# EasyEDA Pro project 毕业设计.eprj, board PCB2
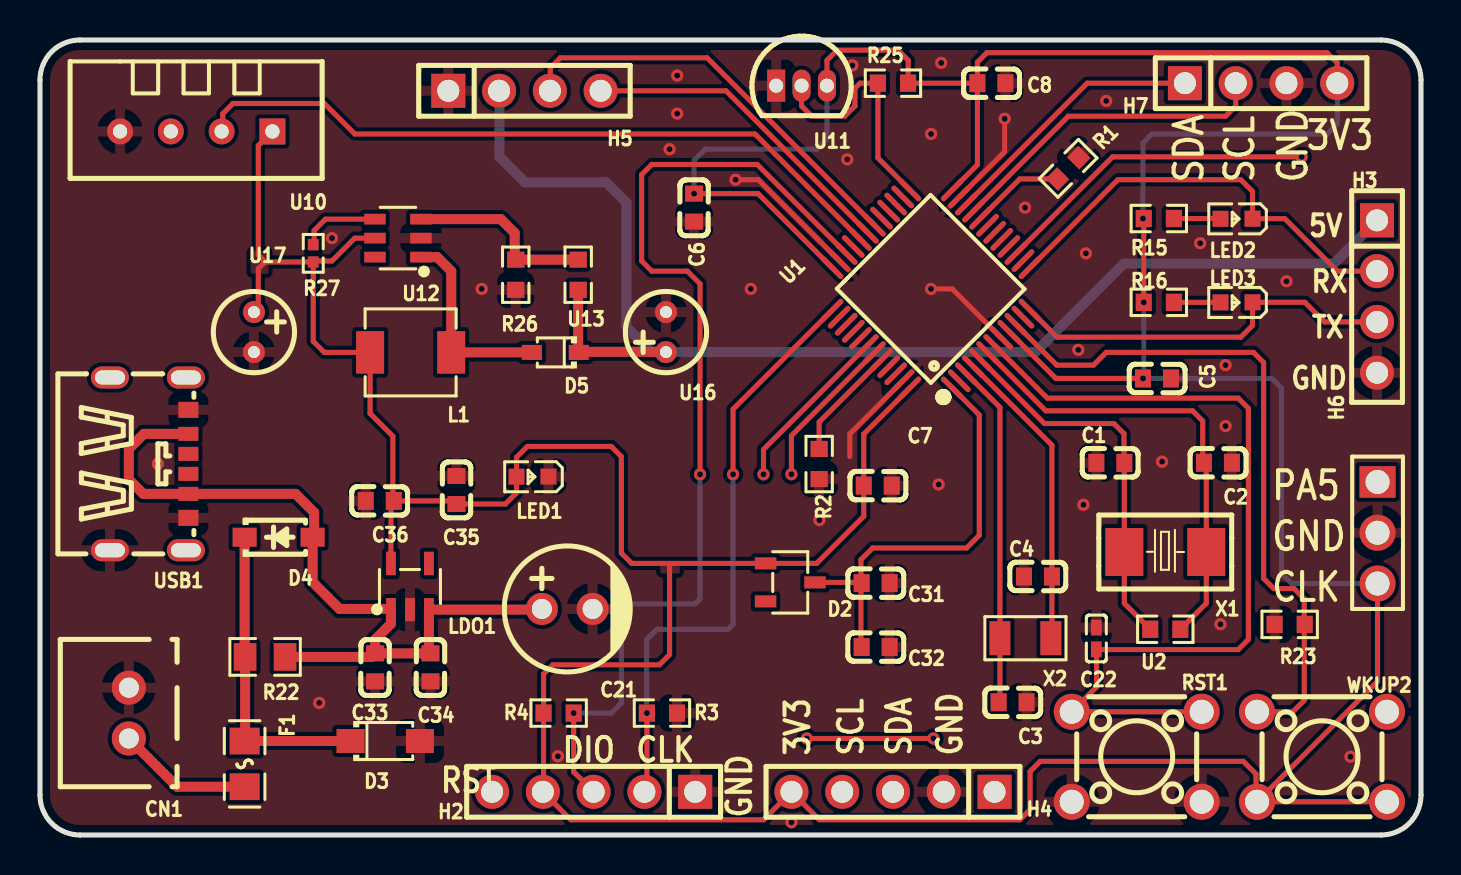
[diagram p5: board, top side]
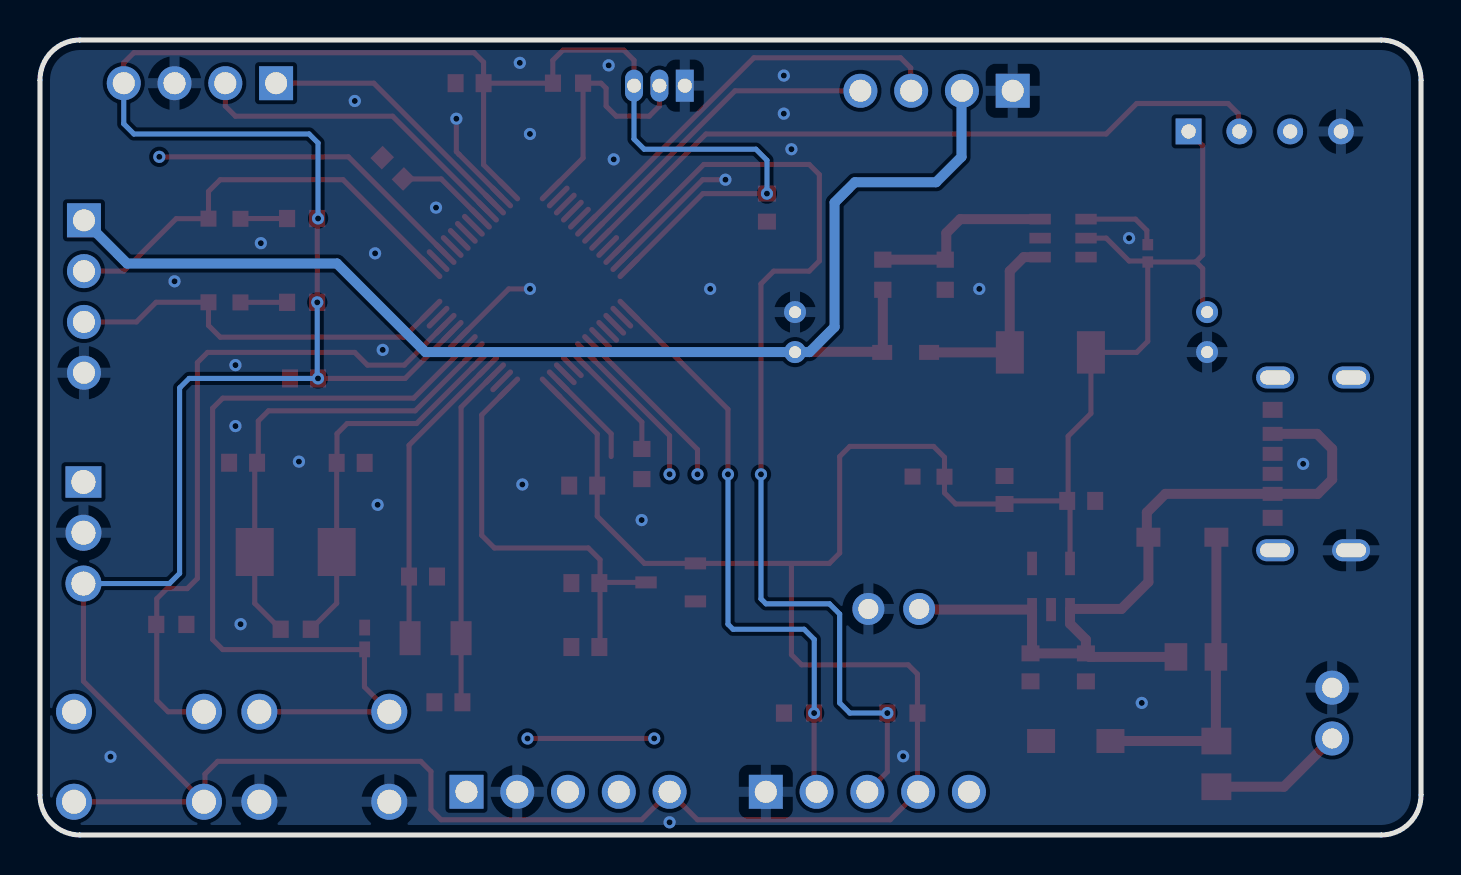
[diagram p6: board, bottom side, seen from below]

Outline 69.09 x 39.75 mm; copper layers: Top Layer, Inner1, Inner2, Bottom Layer. Coordinates in mm from the lower left corner of the outline.
Outline path: 0,37.75 0,2 arc(0.59,0.59) 2,0 67.09,0 arc(68.5,0.59) 69.09,2 69.09,37.75 arc(68.5,39.17) 67.09,39.75 2,39.75 arc(0.59,39.17) 0,37.75
Stack: Top Layer 0.035mm / Dielectric1 1.51mm FR4 er 4.5 / Inner1 0.035mm / Dielectric2 0.48mm PP er 4.5 / Inner2 0.035mm / Dielectric3 0.48mm PP er 4.5 / Bottom Layer 0.035mm

## Design rules (mm)
template: JLCPCB Capability(Two Layers Board)
spacing copperThickness1oz (default): track to track 0.102, other pairs 0.152 to 0.3
spacing copperThickness2oz: track to track 0.203, other pairs 0.152 to 0.3
track width copperThickness1oz (default): min 0.127, default 0.254, max 2.54
track width copperThickness2oz: min 0.203, default 0.254, max 2.54
differential pair differentialPair (default): width min 0.127, default 0.254, max 2.54; gap min 0.152, default 0.152
via viaSize (default): diameter min 0.5, default 0.61, max 10; hole min 0.3, default 0.305, max 6.3

## Placement (name value [footprint] x y rotation side)
C1  20pF  [C0603]  53.55 18.61 0 top
C2  20pF  [C0603]  58.93 18.61 180 top
C3  20pF  [C0603]  48.66 6.64 180 top
C4  20pF  [C0603]  49.92 12.92 0 top
C5  100nF  [C0603]  55.88 22.83 180 top
C6  100nF  [C0603]  32.72 31.37 90 top
C7  100nF  [C0603]  41.91 17.47 180 top
C8  100nF  [C0603]  47.6 37.59 180 top
C21  220uF  [CAP-TH_BD6.3-P2.50-D1.0-FD]  26.38 11.3 0 top
C22  100nF  [C0402]  52.85 9.83 90 top
C31  100nF  [C0603]  41.8 12.6 180 top
C32  100nF  [C0603]  41.8 9.4 180 top
C33  100nF  [C0603]  16.76 8.38 90 top
C34  100nF  [C0603]  19.54 8.38 90 top
C35  100nF  [C0603]  20.84 17.25 270 top
C36  100nF  [C0603]  17 16.71 0 top
CN1  B2B-XH-A(LF)(SN)  [CONN-TH_B2B-XH-A-LF-SN]  4.45 6.1 90 top
D2  BAT54C  [SOT-23-3_L2.9-W1.6-P1.90-LS2.8-BR]  37.53 12.63 180 top
D3  SMF5.0A  [SOD-123FL_L2.7-W1.8-LS3.8-RD]  17.27 4.7 0 top
D4  B5819W SL  [SOD-123_L2.7-W1.6-LS3.7-RD-1]  11.94 14.89 0 top
D5  1SS315TPH3F  [SOD-323_L1.8-W1.3-LS2.5-RD]  25.78 24.13 180 top
F1  BSMD0805-100-6V  [F0805]  10.24 3.56 90 top
H2  PZ254V-11-05P  [HDR-TH_5P-P2.54-V-M]  27.7 2.16 180 top
H3  2.54-1*4P母  [HDR-TH_4P-P2.54-V-F]  66.89 26.92 270 top
H4  PZ254V-11-05P  [HDR-TH_5P-P2.54-V-M]  42.67 2.16 180 top
H5  2.54-1*4P母  [HDR-TH_4P-P2.54-V-F]  24.24 37.21 0 top
H6  2.54-1*3P针  [HDR-TH_3P-P2.54-V-M-1]  66.91 15.11 270 top
H7  2.54-1*4P母  [HDR-TH_4P-P2.54-V-F]  61.09 37.59 0 top
L1  4.7uH  [IND-SMD_L4.4-W4.2]  18.54 24.13 180 top
LDO1  ME6211C33M5G-N  [SOT-23-5_L3.0-W1.7-P0.95-LS2.8-BL]  18.51 12.42 0 top
LED1  NCD0603R1  [LED0603-RD_RED]  24.64 17.92 180 top
LED2  19-217/GHC-YR1S2/3T  [LED0603-RD]  59.86 30.81 180 top
LED3  NCD0603B1  [LED0603-RD]  59.86 26.63 180 top
R1  10kΩ  [R0603]  51.44 33.34 225 top
R2  10kΩ  [R0603]  38.98 18.55 90 top
R3  10kΩ  [R0603]  31.11 6.1 180 top
R4  10kΩ  [R0603]  25.95 6.1 0 top
R15  10kΩ  [R0603]  55.97 30.82 180 top
R16  10kΩ  [R0603]  55.97 26.63 180 top
R22  100mΩ  [R0805]  11.26 8.9 0 top
R23  10kΩ  [R0603]  62.52 10.53 180 top
R25  4.7kΩ  [R0603]  42.67 37.59 0 top
R26  10kΩ  [R0603]  23.8 28.01 90 top
R27  100kΩ  [R0402]  13.67 29.08 90 top
RST1  TS665CJ  [SW-TH_4P-L6.0-W6.0-P4.50-LS6.5]  54.86 3.91 0 top
U1  STM32F103C8T6  [LQFP-48_L7.0-W7.0-P0.50-LS9.0-BL]  44.58 27.3 45 top
U2  1MΩ  [R0603]  56.3 10.29 180 top
U10  DHT11  [SENSOR-TH_DHT11]  7.82 35.18 180 top
U11  DS18B20  [TO-92-3_L4.9-W3.7-P1.27-L]  38.1 37.47 0 top
U12  SX1308  [SOT-23-6_L2.9-W1.6-P0.95-LS2.8-BL]  17.91 29.84 90 top
U13  73.2kΩ  [R0603]  26.92 28.01 270 top
U16  22uF  [CAP-TH_BD4.0-P2.00-D0.5-FD]  31.32 25.15 90 top
U17  22uF  [CAP-TH_BD4.0-P2.00-D0.5-FD]  10.7 25.15 270 top
USB1  TYPE-C 6P(073)  [TYPE-C-SMD_TYPE-C-6P]  5.46 18.56 270 top
WKUP2  TS665CJ  [SW-TH_4P-L6.0-W6.0-P4.50-LS6.5]  64.14 3.91 0 top
X1  8MHz  [CRYSTAL-SMD_L5.0-W3.2]  56.3 14.15 180 top
X2  32.768kHz  [OSC-SMD_L3.2-W1.5]  49.3 9.84 180 top

## Footprints (pads in the part's own frame, mm; a bottom-side part is the same pattern mirrored in y, then rotated)
C0402
  rect 0.79x0.54 smd: 1(-0.545,0) 2(0.545,0)
C0603
  rect 0.8x0.9 smd: 1(-0.7,0) 2(0.7,0)
CAP-TH_BD4.0-P2.00-D0.5-FD
  round 1.1 hole 0.6: 1(-1,0) 2(1,0)
CAP-TH_BD6.3-P2.50-D1.0-FD
  round 1.6 hole 1: 1(-1.27,0) 2(1.27,0)
CONN-TH_B2B-XH-A-LF-SN
  round 1.7 hole 1: 1(1.27,0) 2(-1.27,0)
CRYSTAL-SMD_L5.0-W3.2
  rect 1.9x2.4 smd: 1(-2.05,0) 2(2.05,0)
F0805
  rect 1.335x1.5 smd: 1(-1.143,0) 2(1.143,0)
HDR-TH_3P-P2.54-V-M-1
  rect 1.575x1.8 hole 1.2: 1(-2.54,0)
  round 1.8 hole 1.2: 2(0,0) 3(2.54,0)
HDR-TH_4P-P2.54-V-F
  rect 1.7x1.7 hole 1.1: 1(-3.81,0)
  round 1.7 hole 1.1: 2(-1.27,0) 3(1.27,0) 4(3.81,0)
HDR-TH_5P-P2.54-V-M
  rect 1.7x1.7 hole 1.1: 1(-5.08,0)
  round 1.7 hole 1.1: 2(-2.54,0) 3(0,0) 4(2.54,0) 5(5.08,0)
IND-SMD_L4.4-W4.2
  rect 1.4x2.12 smd: 1(2.028,0) 2(-2.028,0)
LED0603-RD
  rect 0.8x0.8 smd: 1(-0.799,-0.004) 2(0.799,0.004)
LED0603-RD_RED
  rect 0.8x0.8 smd: 1(-0.799,-0.004) 2(0.799,0.004)
LQFP-48_L7.0-W7.0-P0.50-LS9.0-BL
  oval 0.27x1.5 smd: 1(-2.75,-4.25) 2(-2.25,-4.25) 3(-1.75,-4.25) 4(-1.25,-4.25) 5(-0.75,-4.25) 6(-0.25,-4.25) 7(0.25,-4.25) 8(0.75,-4.25) 9(1.25,-4.25) 10(1.75,-4.25) 11(2.25,-4.25) 12(2.75,-4.25) 25(2.75,4.25) 26(2.25,4.25) 27(1.75,4.25) 28(1.25,4.25) 29(0.75,4.25) 30(0.25,4.25) 31(-0.25,4.25) 32(-0.75,4.25) 33(-1.25,4.25) 34(-1.75,4.25) 35(-2.25,4.25) 36(-2.75,4.25)
  oval 1.5x0.27 smd: 13(4.25,-2.75) 14(4.25,-2.25) 15(4.25,-1.75) 16(4.25,-1.25) 17(4.25,-0.75) 18(4.25,-0.25) 19(4.25,0.25) 20(4.25,0.75) 21(4.25,1.25) 22(4.25,1.75) 23(4.25,2.25) 24(4.25,2.75) 37(-4.25,2.75) 38(-4.25,2.25) 39(-4.25,1.75) 40(-4.25,1.25) 41(-4.25,0.75) 42(-4.25,0.25) 43(-4.25,-0.25) 44(-4.25,-0.75) 45(-4.25,-1.25) 46(-4.25,-1.75) 47(-4.25,-2.25) 48(-4.25,-2.75)
OSC-SMD_L3.2-W1.5
  rect 1.05x1.7 smd: 1(-1.275,0) 2(1.275,0)
R0402
  rect 0.566x0.54 smd: 1(-0.433,0) 2(0.433,0)
R0603
  rect 0.806x0.864 smd: 1(-0.753,0) 2(0.753,0)
R0805
  rect 1.133x1.377 smd: 1(-1,0) 2(1,0)
SENSOR-TH_DHT11
  rect 1.296x1.296 hole 0.711: 1(-3.81,0)
  round 1.296 hole 0.711: 2(-1.27,0) 3(1.27,0) 4(3.81,0)
SOD-123_L2.7-W1.6-LS3.7-RD-1
  rect 1.2x0.95 smd: 1(-1.7,0) 2(1.7,0)
SOD-123FL_L2.7-W1.8-LS3.8-RD
  rect 1.4x1.2 smd: 1(-1.735,0) 2(1.735,0)
SOD-323_L1.8-W1.3-LS2.5-RD
  rect 1x0.75 smd: 1(-1.173,0) 2(1.173,0)
SOT-23-3_L2.9-W1.6-P1.90-LS2.8-BR
  rect 1.07x0.6 smd: 1(1.235,-0.95) 2(1.235,0.95) 3(-1.235,0)
SOT-23-5_L3.0-W1.7-P0.95-LS2.8-BL
  rect 0.49x1.157 smd: 1(-0.95,-1.153) 2(0,-1.153) 3(0.95,-1.153)
  rect 0.49x1.175 smd: 4(0.95,1.153) 5(-0.95,1.153)
SOT-23-6_L2.9-W1.6-P0.95-LS2.8-BL
  rect 0.532x1.072 smd: 1(-0.95,-1.149) 2(0,-1.149) 3(0.95,-1.149) 4(0.95,1.149) 5(0,1.149) 6(-0.95,1.149)
SW-TH_4P-L6.0-W6.0-P4.50-LS6.5
  round 1.8 hole 1.2: 1(-3.25,2.25) 2(3.25,2.25) 3(-3.25,-2.25) 4(3.25,-2.25)
TO-92-3_L4.9-W3.7-P1.27-L
  rect 0.9x1.6 hole 0.7: 1(-1.27,0)
  oval 0.9x1.6 hole 0.7: 2(0,0) 3(1.27,0)
TYPE-C-SMD_TYPE-C-6P
  oval 1.1x1.9 hole 0.7x1.5: 7(-4.32,1.837) 7(-4.32,-1.962) 7(4.32,1.837) 7(4.32,-1.962)
  rect 0.7x1 smd: A5(-0.5,1.962) A9(1.5,1.962) B5(0.5,1.962) B9(-1.5,1.962)
  rect 0.8x1 smd: A12(2.7,1.962) B12(-2.7,1.962)

## Nets
As in the schematic.

Pads without a net: D2 2; H4 1; LDO1 4; U1 2 11 14 16 17 18 19 26 27 28 29 33 38 41 45 46; U10 3; U12 6; USB1 A5 B5; WKUP2 2

## Via types
v1: diameter 0.61, hole 0.301, Top Layer to Bottom Layer, 44 vias

## Routing (per net, layer and track width the routed paths; a pad name or vN(x,y) marks a point on that pad's centre or on a via; arc(x,y) is an arc through that point)
3V3: length 261.3
  Top Layer w0.254: 11.27,28.65 11.25,28.65 10.92,28.32 10.92,26.37 U17.1 ; 11.27,28.65 R27.1 ; 11.27,28.65 10.92,29 10.92,34.47 U10.1 ; 46.9,37.59 46.9,33.51 U1.24 ; 46.9,37.59 R25.2 43.43,37.6 43.43,38.73 42.93,39.24 39.88,39.24 39.37,38.73 U11.3 ; 46.9,37.59 46.9,38.64 47.37,39.12 64.39,39.12 64.9,38.61 H7.4 ; R27.1 13.72,28.7 14.61,28.7 15.75,29.84 U12.5 ; R27.1 13.67,24.68 14.22,24.13 16.51,24.13 16.51,21.08 17.65,19.94 17.65,16.75 C36.2 ; C36.2 17.56,16.56 LDO1.5 ; C36.2 20.68,16.71 C35.2 23.28,16.55 23.84,17.11 LED1.2 23.84,18.89 24.38,19.43 28.58,19.43 29.08,18.92 29.08,14.1 29.6,13.58 D2.1 38.85,13.58 41.21,15.94 C7.2 41.21,20.05 U1.48 ; v1(32.72,32.07) 35.92,32.07 U1.36 ; H6.3 66.91,7.69 WKUP2.3 ; v1(55.18,22.83) 50.82,22.83 U1.9 ; R15.2 v1(55.22,26.63) ; WKUP2.3 60.83,1.71 60.83,3.05 60.2,3.68 50.04,3.68 49.53,3.17 49.53,1.27 49.02,0.76 38.99,0.76 H4.5 36.2,0.76 26.55,0.76 H2.4 25.19,2.19 25.19,8.05 25.65,8.51 30.99,8.51 31.5,9.02 31.5,13.58 ; WKUP2.3 WKUP2.4
  Bottom Layer w0.254: v1(55.18,30.82) 55.18,34.6 55.63,35.05 64.39,35.05 64.9,35.56 H7.4 ; v1(32.72,32.07) 32.72,33.74 33.27,34.29 38.86,34.29 39.37,34.8 U11.3 ; H6.3 62.61,12.57 62.1,13.08 62.1,22.35 61.63,22.83 v1(55.18,22.83) 55.22,22.87 v1(55.22,26.63)
4V2_IN: length 15.5
  Top Layer w0.5: D3.1 10.29,4.7 10.26,4.72 ; D4.1 10.24,8.93 R22.1 10.26,4.72 ; 10.26,4.72 F1.2
+5V: length 65.2
  Top Layer w0.5: 26.92,24.16 31.3,24.16 U16.1 ; 26.92,24.16 D5.1 ; 26.92,24.16 U13.2
  Bottom Layer w0.5: H5.2 22.99,37.19 22.99,33.91 24.26,32.64 28.32,32.64 29.34,31.62 29.34,25.4 30.59,24.15 U16.1 49.8,24.15 54.23,28.57 64.73,28.57 H3.1
GND: length 21.2
  Top Layer w0.254: v1(44.58,27.3) 45.64,27.3 48.11,24.83 ; 48.13,34.04 48.26,34.17 v1(48.26,35.81) ; 48.13,34.04 48.13,34.04 ; 48.13,34.04 U1.23 ; U1.35 35.93,32.77 v1(34.8,32.77) ; U1.47 40.51,20.06 40.51,18.92
  vias: v1(5.9,18.56) v1(13.97,6.6) v1(14.61,29.84) v1(22.1,27.3) v1(25.91,3.94) v1(31.5,34.29) v1(31.88,37.97) v1(31.88,36.07) v1(35.56,27.3) v1(37.59,0.63) v1(38.99,15.75) v1(40.39,33.78) v1(40.64,38.48) v1(44.58,35.05) v1(44.96,17.53) v1(45.08,38.61) v1(49.28,31.37) v1(51.94,24.26) v1(52.2,16.51) v1(52.32,29.08) v1(53.34,36.7) v1(56.13,18.67) v1(58.04,29.59) v1(59.05,10.54) v1(59.31,23.49) v1(59.31,20.45) v1(62.36,27.69) v1(65.56,3.91)
VBAT: length 21.1
  Top Layer w0.254: 41.07,12.63 41.07,9.43 C32.2 ; 41.07,12.63 41.07,13.77 41.66,14.35 46.36,14.35 46.99,14.99 46.99,21 U1.1 ; 41.07,12.63 C31.2 ; 41.07,12.63 D2.3
VBUS: length 40.5
  Top Layer w0.5: C33.2 16.76,9.77 17.56,10.56 LDO1.1 17.53,11.3 14.99,11.3 13.64,12.65 D4.2 13.72,14.97 13.72,16.13 12.79,17.06 USB1.A9 5.17,17.06 4.45,17.78 4.45,19.3 5.2,20.06 USB1.B9 ; C33.2 C34.2 19.46,9.16 LDO1.3 25.07,11.27 C21.1 ; C33.2 16.59,8.9 R22.2
BOOT0: length 5.8
  Top Layer w0.254: U1.44 38.98,20.65 R2.2
BOOT1: length 4.7
  Top Layer w0.254: R1.2 49.01,32.8 U1.20
DHT11: length 35.8
  Top Layer w0.254: U10.2 9.14,35.24 9.14,36.07 9.65,36.58 14.22,36.58 15.75,35.05 35.77,35.05 41.04,29.78
DS18B20: length 12.3
  Top Layer w0.254: U1.25 41.92,33.85 R25.1 41.02,37.59 40.77,37.34 40.77,36.45 40.26,35.94 38.61,35.94 38.1,36.45 U11.2
I2C1_SCL: length 27.7
  Top Layer w0.254: U1.42 36.2,19.28 v1(36.2,18.03)
  Inner1 w0.254: H4.4 40.13,5.59 39.5,6.22 36.7,6.22 36.2,6.73 v1(36.2,18.03)
I2C1_SDA: length 27.9
  Top Layer w0.254: U1.43 37.59,19.97 v1(37.59,18.04)
  Inner1 w0.254: v1(37.59,18.04) 37.59,8.25 38.23,7.62 41.78,7.62 42.67,6.73 H4.3
I2C2_SCL: length 16.4
  Top Layer w0.254: H7.2 59.82,36.45 59.31,35.94 51.45,35.94 46.7,31.19
I2C2_SDA: length 13.4
  Top Layer w0.254: H7.1 52.39,37.59 U1.22
NRST: length 75.4
  Top Layer w0.254: v1(38.36,4.83) v1(44.7,4.83) ; 52.86,9.27 52.86,7.4 RST1.1 RST1.2 ; 52.86,9.27 C22.1 ; 52.86,9.27 59.94,9.27 60.45,9.78 60.45,21.34 59.94,21.84 50.39,21.84 U1.7
  Inner1 w0.254: v1(44.7,4.83) 50.28,4.83 RST1.1 ; H2.5 22.62,4.33 23.11,4.83 v1(38.36,4.83)
OSC32_IN: length 17.1
  Top Layer w0.254: U1.3 48.02,21.38 X2.2 48.02,6.7 C3.2
OSC32_OUT: length 15.2
  Top Layer w0.254: X2.1 50.62,9.89 C4.2 50.62,19.49 46.7,23.42
OSC_IN: length 19
  Top Layer w0.254: U2.2 54.25,11.58 X1.2 C1.2 54.23,18.62 54.23,20.07 53.72,20.57 50.25,20.57 U1.5
OSC_OUT: length 23.2
  Top Layer w0.254: U1.6 50.32,21.21 57.66,21.21 58.17,20.7 58.17,18.67 58.35,18.5 X1.1 58.35,11.58 57.05,10.29
PA5: length 35.9
  Top Layer w0.254: v1(63.12,33.91) 53.66,33.91 U1.15
  Inner1 w0.254: H6.1 63.88,17.65 63.12,18.41 v1(63.12,33.91)
SWCLK: length 30.1
  Top Layer w0.254: U1.37 34.67,21.29 v1(34.67,18.03) ; 30.35,6.09 v1(30.36,6.1) 30.36,2.28 H2.2
  Bottom Layer w0.254: v1(30.36,6.1) 30.35,6.1 30.35,9.78 30.86,10.29 34.42,10.29 34.67,10.54 v1(34.67,18.03)
SWDIO: length 51.4
  Top Layer w0.254: v1(26.7,6.1) 26.7,3.16 H2.3 ; U1.34 35.88,33.53 30.61,33.53 30.1,33.02 30.1,28.7 30.61,28.19 32.39,28.19 33.02,27.56 v1(33.02,18.03)
  Bottom Layer w0.254: v1(26.7,6.1) 28.58,6.1 29.08,6.6 29.08,11.05 29.59,11.56 32.77,11.56 33.02,11.81 v1(33.02,18.03)
USART1_RX: length 16.3
  Top Layer w0.254: U1.31 34.32,37.21 H5.4
USART1_TX: length 21.1
  Top Layer w0.254: U1.30 33.37,38.86 26.04,38.86 25.53,38.35 25.53,37.23 H5.3
USART2_RX: length 21.9
  Top Layer w0.254: U1.13 53.93,32.77 60.07,32.77 60.66,32.18 LED2.1 62.27,30.82 64.9,28.19 H3.2
USART2_TX: length 19.7
  Top Layer w0.254: H3.3 64.26,25.65 63.28,26.64 LED3.1 60.66,25.48 60.07,24.89 50.88,24.89 U1.12
WKUP: length 34.7
  Top Layer w0.254: WKUP2.1 62.68,6.16 63.25,6.73 63.25,10.51 R23.1 63.25,10.55 63.25,11.81 62.74,12.32 61.72,12.32 61.21,12.83 61.21,23.62 60.71,24.13 53.34,24.13 52.7,23.49 50.86,23.49 U1.10
$1N2791: length 6.8
  Top Layer w0.5: CN1.2 6.86,2.41 F1.1
$1N10003: length 4
  Top Layer w0.254: U12.4 14.29,30.8 13.72,30.23 13.72,29.56 R27.2
$1N10023: length 9.9
  Top Layer w0.5: U12.1 19.87,28.89 20.57,28.19 20.57,24.13 ; 20.57,24.13 L1.2 ; 20.57,24.13 20.58,24.13 D5.2
$1N10031: length 9.5
  Top Layer w0.5: U12.3 23.05,30.8 23.75,30.1 23.75,28.82 R26.2 U13.1
$2N1003: length 2.3
  Top Layer w0.254: R15.1 59.05,30.82 LED2.2
$2N1004: length 2.3
  Top Layer w0.254: R16.1 59.06,26.63 59.06,26.63

## Copper pours and planes (outline as drawn; the poured copper is in the pictures)
3V3 on Top Layer: 10.54,29.21 11.43,29.21 11.43,28.07 10.54,28.07
GND on Top Layer: -14.48,53.21 71.76,53.21 71.76,-2.79 -14.48,-2.79
GND on Bottom Layer: -9.14,48.26 74.8,48.26 74.8,-6.22 -9.14,-6.22
GND on Inner1: -4.06,44.32 78.49,44.32 78.49,-10.67 -4.06,-10.67
GND on Inner2: -1.27,41.78 80.9,41.78 80.9,-13.72 -1.27,-13.72

Small or netless copper shapes (teardrops, artwork), in the pictures only: 1 on Top Layer

## Text on the board
Top Silkscreen Layer: GND | 5V | RX | TX | RST | 3V3 | SCL | SDA | DIO | CLK | PA5
